# Altium schematic sheet Sheet2.SchDoc
size 431 x 279 mm; Organization: ORGANIZATION; Address1: ADDRESS 1; Address2: ADDRESS 2; Address3: ADDRESS 3; Address4: ADDRESS 4; Revision: -; SheetNumber: 4; SheetTotal: 4; ENG_APP_DATE: --/--/--; DSN_APP_DATE: --/--/--; CHK_APP_DATE: --/--/--
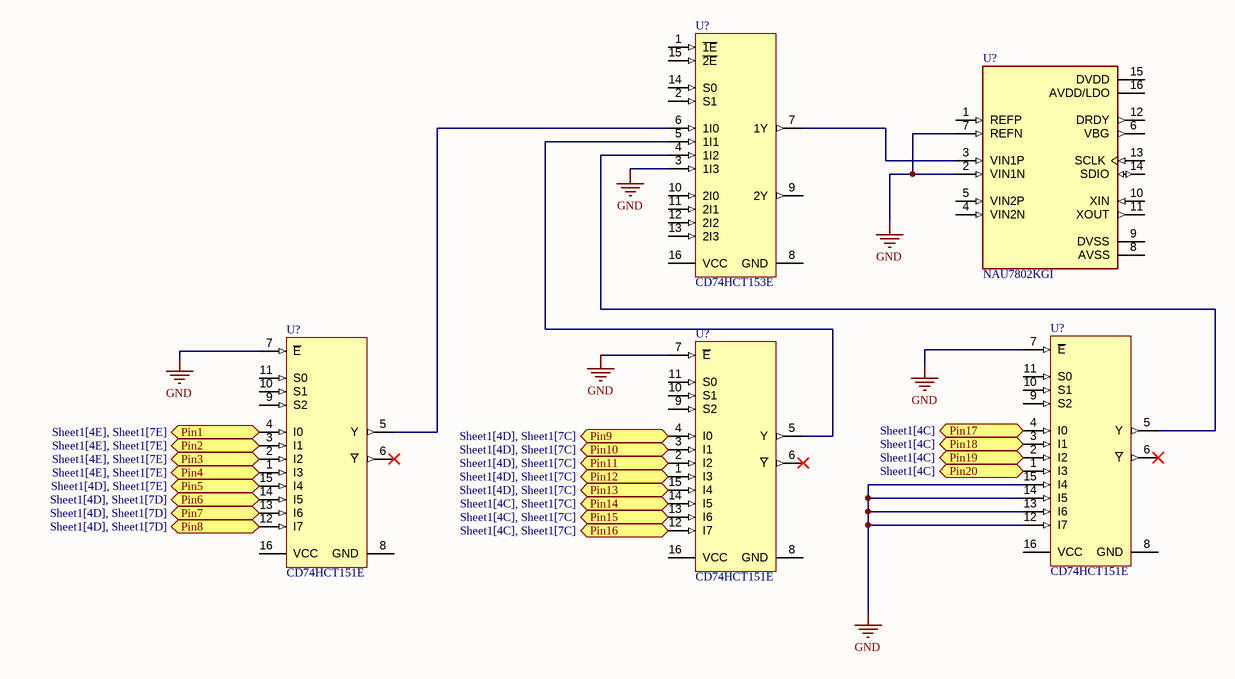
[diagram p0: Sheet2.SchDoc]

## Parts
(Parts that share a designator on the sheet are numbered #1, #2 ... from top to bottom, then left to right.)
U?#1  CD74HCT153E  [N0016A]
U?#2  NAU7802KGI  [DIP792W45P254L1904H533Q16]
U?#3  CD74HCT151E  [N0016A]
U?#4  CD74HCT151E  [N0016A]
U?#5  CD74HCT151E  [N0016A]

## Ports
Pin1 (bidir, see Sheet1[4E], Sheet1[7E]), Pin2 (bidir, see Sheet1[4E], Sheet1[7E]), Pin3 (bidir, see Sheet1[4E], Sheet1[7E]), Pin4 (bidir, see Sheet1[4E], Sheet1[7E]), Pin5 (bidir, see Sheet1[4D], Sheet1[7E]), Pin6 (bidir, see Sheet1[4D], Sheet1[7D]), Pin7 (bidir, see Sheet1[4D], Sheet1[7D]), Pin8 (bidir, see Sheet1[4D], Sheet1[7D]), Pin9 (bidir, see Sheet1[4D], Sheet1[7C]), Pin10 (bidir, see Sheet1[4D], Sheet1[7C]), Pin11 (bidir, see Sheet1[4D], Sheet1[7C]), Pin12 (bidir, see Sheet1[4D], Sheet1[7C]), Pin13 (bidir, see Sheet1[4D], Sheet1[7C]), Pin14 (bidir, see Sheet1[4C], Sheet1[7C]), Pin15 (bidir, see Sheet1[4C], Sheet1[7C]), Pin16 (bidir, see Sheet1[4C], Sheet1[7C]), Pin17 (bidir, see Sheet1[4C]), Pin18 (bidir, see Sheet1[4C]), Pin19 (bidir, see Sheet1[4C]), Pin20 (bidir, see Sheet1[4C])

## Nets
GND: U?#1.3(1I3) U?#2.2(VIN1N) U?#2.7(REFN) U?#3.7(~{E}) U?#4.7(~{E}) U?#4.12(I7) U?#4.13(I6) U?#4.14(I5) U?#4.15(I4) U?#5.7(~{E})
Pin1: U?#3.4(I0) ; port Pin1
Pin2: U?#3.3(I1) ; port Pin2
Pin3: U?#3.2(I2) ; port Pin3
Pin4: U?#3.1(I3) ; port Pin4
Pin5: U?#3.15(I4) ; port Pin5
Pin6: U?#3.14(I5) ; port Pin6
Pin7: U?#3.13(I6) ; port Pin7
Pin8: U?#3.12(I7) ; port Pin8
Pin9: U?#5.4(I0) ; port Pin9
Pin10: U?#5.3(I1) ; port Pin10
Pin11: U?#5.2(I2) ; port Pin11
Pin12: U?#5.1(I3) ; port Pin12
Pin13: U?#5.15(I4) ; port Pin13
Pin14: U?#5.14(I5) ; port Pin14
Pin15: U?#5.13(I6) ; port Pin15
Pin16: U?#5.12(I7) ; port Pin16
Pin17: U?#4.4(I0) ; port Pin17
Pin18: U?#4.3(I1) ; port Pin18
Pin19: U?#4.2(I2) ; port Pin19
Pin20: U?#4.1(I3) ; port Pin20
NetU?#1_4: U?#1.4(1I2) U?#4.5(Y)
NetU?#1_5: U?#1.5(1I1) U?#5.5(Y)
NetU?#1_6: U?#1.6(1I0) U?#3.5(Y)
NetU?#1_7: U?#1.7(1Y) U?#2.3(VIN1P)

Not connected (* = marked no-connect by the designer): U?#1 1(~{1E}) 2(S1) 8(GND) 9(2Y) 10(2I0) 11(2I1) 12(2I2) 13(2I3) 14(S0) 15(~{2E}) 16(VCC); U?#2 1(REFP) 4(VIN2N) 5(VIN2P) 6(VBG) 8(AVSS) 9(DVSS) 10(XIN) 11(XOUT) 12(DRDY) 13(SCLK) 14(SDIO) 15(DVDD) 16(AVDD/LDO); U?#3 6(~{Y})* 8(GND) 9(S2) 10(S1) 11(S0) 16(VCC); U?#4 6(~{Y})* 8(GND) 9(S2) 10(S1) 11(S0) 16(VCC); U?#5 6(~{Y})* 8(GND) 9(S2) 10(S1) 11(S0) 16(VCC)

## Notes on the sheet
- DWG. NO.
- REV.
- SHT.
- THIS DOCUMENT AND THE DATA DISCLOSED HEREIN OR HEREWITH IS THE PROPERTY OF ALTIUM LIMITED AND MAY BE FREELY DISTRIBUTED IN WHOLE. NO RIGHTS ARE RESERVED OR EXPRESS OR IMPLIED WARANTEE GIVEN.
- REVISION
- DESCRIPTION
- DATE
- APPROVED
- ENG:
- APPROVALS
- PROJECT
- DSN:
- CHK:
- REFERENCE DOCUMENTS
- PROJECT REVISION:
- TITLE
- DOCUMENT REVISION:
- DESIGN ITEM:
- BOM:
- FAB DWG:
- PCB DWG:
- ASSY DWG:
- SCALE:
- SIZE
- B
- CAGE CODE
- FILE NAME
- DWG NO.
- SHEET
- OF
- REV

## Library data of the parts
U?#1 = CMP-1633-00665-2: High Speed CMOS Logic Dual 4-Input Multiplexers, N0016A, TUBE; Manufacturer: Texas Instruments; VCC(Max)(V): 5.5; Voltage(Nom)(V): 5; ICC @ Nom Voltage(Max)(mA): 0.08; Configuration: 4：1; Rating: Catalog; tpd @ Nom Voltage(Max)(ns): 43; F @ Nom Voltage(Max)(Mhz): 25; VCC(Min)(V): 4.5; Function: Encoder/Multiplexer; Technology Family: HCT; Schmitt Trigger: No; Bits(#): 4; Input Type: TTL; Channels(#): 2; Output Drive (IOL/IOH)(Max)(mA): 4/-4; Output Type: CMOS; Operating Temperature Range(C): -55 to 125; Type: Standard; Code_JEDEC: MS-001; Generic Part Number: CD74HCT153; PackageReference: N0016A; DatasheetVersion: SCHS151C
U?#2 = CMP-00254-1: 24 Bit Analog to Digital Converter 2 Input 1 Sigma-Delta 16-PDIP; MF: Nuvoton Technology Corporation of America; Source: NAU7802KGI.SchLib; SnapEDA_Link: https://www.snapeda.com/parts/NAU7802KGI/Nuvoton/view-part/?ref=snap; Check_prices: https://www.snapeda.com/parts/NAU7802KGI/Nuvoton/view-part/?ref=eda; Pin Count: 16; Package: Package; Component Type: Standard; Value: *; Design Item ID: NAU7802KGI; MP: NAU7802KGI
U?#3-U?#5 = CMP-1633-00678-2: High Speed CMOS Logic 8-Input Multiplexer, N0016A, TUBE; Manufacturer: Texas Instruments; Output Drive (IOL/IOH)(Max)(mA): 4/-4; Technology Family: HCT; Input Type: TTL; F @ Nom Voltage(Max)(Mhz): 25; Rating: Catalog; Bits(#): 8; VCC(Min)(V): 4.5; VCC(Max)(V): 5.5; Schmitt Trigger: No; tpd @ Nom Voltage(Max)(ns): 48; ICC @ Nom Voltage(Max)(mA): 0.08; Channels(#): 1; Function: Encoder/Multiplexer; Configuration: 8：1; Voltage(Nom)(V): 5; Generic Part Number: CD74HCT151; PackageReference: N0016A; Output Type: CMOS; Code_JEDEC: MS-001; DatasheetVersion: SCHS150C; Type: Standard; Operating Temperature Range(C): -55 to 125